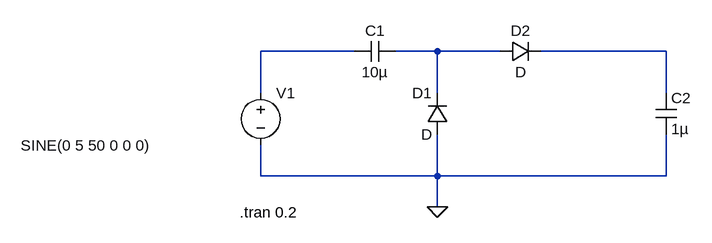
[diagram p0: schematic Diodo - Dobrador_de_Tensao.asc]
Diodo - Dobrador_de_Tensao.asc, the LTspice schematic file:
Version 4
SHEET 1 880 680
WIRE 160 96 16 96
WIRE 288 96 224 96
WIRE 384 96 288 96
WIRE 640 96 448 96
WIRE 16 160 16 96
WIRE 288 160 288 96
WIRE 640 160 640 96
WIRE 16 288 16 240
WIRE 288 288 288 224
WIRE 288 288 16 288
WIRE 640 288 640 224
WIRE 640 288 288 288
WIRE 288 336 288 288
FLAG 288 336 0
SYMBOL voltage 16 144 R0
WINDOW 3 -369 97 Left 2
WINDOW 123 0 0 Left 2
WINDOW 39 0 0 Left 2
SYMATTR Value SINE(0 5 50 0 0 0)
SYMATTR InstName V1
SYMBOL cap 160 112 R270
WINDOW 0 32 32 VTop 2
WINDOW 3 0 32 VBottom 2
SYMATTR InstName C1
SYMATTR Value 10µ
SYMBOL diode 304 224 R180
WINDOW 0 24 64 Left 2
WINDOW 3 24 0 Left 2
SYMATTR InstName D1
SYMBOL cap 624 160 R0
SYMATTR InstName C2
SYMATTR Value 1µ
SYMBOL diode 384 112 R270
WINDOW 0 32 32 VTop 2
WINDOW 3 0 32 VBottom 2
SYMATTR InstName D2
TEXT -16 344 Left 2 !.tran 0.2

The netlist it stands for:
* Diodo - Dobrador_de_Tensao.asc
V1 N001 0 SINE(0 5 50 0 0 0)
C1 N001 N002 10µ
D1 0 N002 D
C2 N003 0 1µ
D2 N002 N003 D
.model D D
.lib standard.dio
.tran 0.2
.backanno
.end